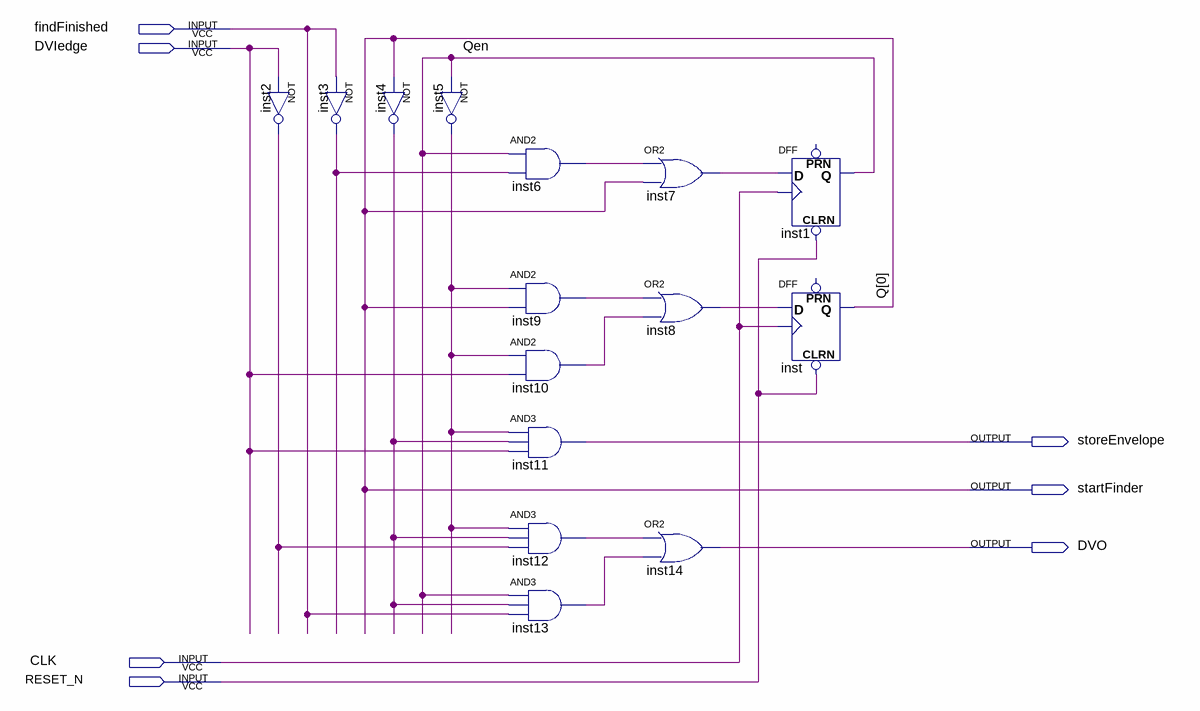
[diagram p0: schematic sheet]
// Quartus schematic factSTM.bdf as structural Verilog: 15 symbols, 7 pins
module factSTM (
  input  findFinished,
  input  DVIedge,
  input  CLK,
  input  RESET_N,
  output storeEnvelope,
  output startFinder,
  output DVO
);

  wire inst2_out, inst3_out, inst4_out, inst5_out, inst6_out, inst7_out, inst8_out, inst9_out, inst10_out,
       inst12_out, inst13_out, Qen;

  not inst2 (inst2_out, DVIedge);
  not inst3 (inst3_out, findFinished);
  not inst4 (inst4_out, startFinder);
  not inst5 (inst5_out, Qen);
  and inst6 (inst6_out, Qen, inst3_out);
  and inst9 (inst9_out, inst5_out, startFinder);
  and inst10 (inst10_out, inst5_out, DVIedge);
  and inst11 (storeEnvelope, inst5_out, inst4_out, DVIedge);
  and inst12 (inst12_out, inst5_out, inst4_out, inst2_out);
  and inst13 (inst13_out, Qen, inst4_out, findFinished);
  or inst7 (inst7_out, inst6_out, startFinder);
  or inst8 (inst8_out, inst9_out, inst10_out);
  or inst14 (DVO, inst12_out, inst13_out);
  DFF inst1 (.CLRN(RESET_N), .CLK(CLK), .D(inst7_out), .Q(Qen));  // open: PRN
  DFF inst (.CLRN(RESET_N), .CLK(CLK), .D(inst8_out), .Q(startFinder));  // open: PRN

  // Other names for the same wires on the sheet: Q[0] = startFinder
endmodule
